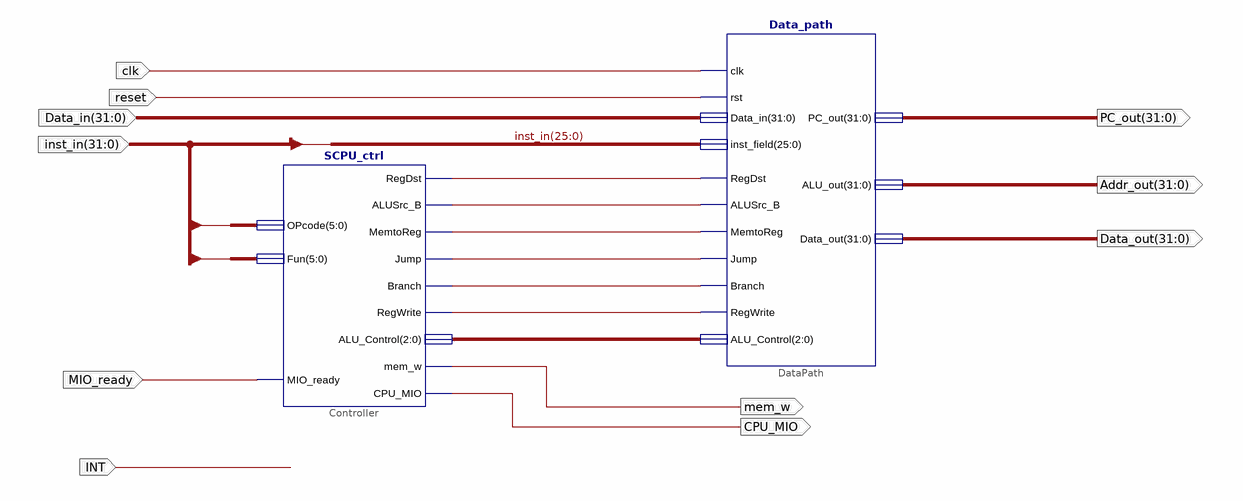
[diagram p0: schematic sheet 1]
// Xilinx ISE schematic SCPU.sch (kintex7) as structural Verilog: 2 symbols, 11 ports
module SCPU (
  input  clk,
  input  reset,
  input  [31:0] Data_in,
  input  MIO_ready,
  input  [31:0] inst_in,
  input  INT,
  output [31:0] PC_out,
  output [31:0] Addr_out,
  output [31:0] Data_out,
  output mem_w,
  output CPU_MIO
);

  wire XLXN_13, XLXN_14, XLXN_15, XLXN_16, XLXN_17, XLXN_18;
  wire [2:0] XLXN_12;

  SCPU_ctrl Controller (
    .RegDst(XLXN_18), .ALUSrc_B(XLXN_17), .MemtoReg(XLXN_16), .Jump(XLXN_15), .Branch(XLXN_14),
    .RegWrite(XLXN_13), .ALU_Control(XLXN_12), .CPU_MIO(CPU_MIO), .mem_w(mem_w), .Fun(inst_in[5:0]),
    .MIO_ready(MIO_ready), .OPcode(inst_in[31:26]));
  Data_path DataPath (
    .RegDst(XLXN_18), .ALUSrc_B(XLXN_17), .MemtoReg(XLXN_16), .Jump(XLXN_15), .Branch(XLXN_14),
    .RegWrite(XLXN_13), .ALU_Control(XLXN_12), .Data_in(Data_in), .inst_field(inst_in[25:0]), .clk(clk),
    .rst(reset), .PC_out(PC_out), .ALU_out(Addr_out), .Data_out(Data_out));
endmodule
